# Altium schematic sheet Heartrate_Monitor_Internal.SchDoc: Heart Rate Monitor Internal
size A4; DocumentNumber: 8; SheetNumber: 8; SheetTotal: 31
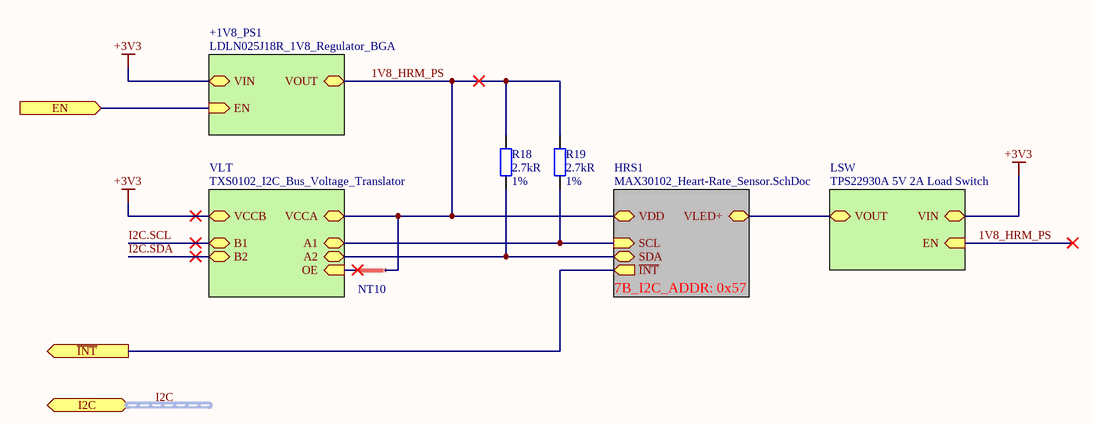
[diagram p0: Heartrate_Monitor_Internal.SchDoc]

## Parts
NT10  Net Tie  [Net Tie 6x30mil]  (value not drawn)  (net tie, no BOM)
R18  Resistance: 2.7kR  Tolerance: 1%  [R0402]  (hidden comment: RES SMD 2.7K OHM 1% 1/16W 0402)
R19  Resistance: 2.7kR  Tolerance: 1%  [R0402]  (hidden comment: RES SMD 2.7K OHM 1% 1/16W 0402)

## Sub-sheets
+1V8_PS1 = LDLN025J18R_1V8_Regulator_BGA: EN (in), VIN, VOUT
HRS1 = MAX30102_Heart-Rate_Sensor.SchDoc: ~{INT} (out), VDD, SCL (in), VLED+, SDA (bidir)  | 7B_I2C_ADDR: 0x57
LSW = TPS22930A 5V 2A Load Switch: EN (in), VOUT, VIN
VLT = TXS0102_I2C_Bus_Voltage_Translator: VCCA, VCCB, OE (in), A1 (bidir), A2 (bidir), B1 (bidir), B2 (bidir)

## Ports
EN (in), I2C (harness I2C), ~{INT} (out)

## Nets
+3V3: sheet +1V8_PS1/VIN, sheet VLT/VCCB, sheet LSW/VIN
1V8_HRM_PS: NT10.2 R18.2 R19.2 ; sheet HRS1/VDD, sheet +1V8_PS1/VOUT, sheet VLT/VCCA, sheet LSW/EN
~{INT}: port ~{INT}, sheet HRS1/~{INT}
EN: port EN, sheet +1V8_PS1/EN
I2C.SCL: sheet VLT/B1
I2C.SDA: sheet VLT/B2
NetNT10_1: NT10.1 ; sheet VLT/OE
NetR18_1: R18.1 ; sheet HRS1/SDA, sheet VLT/A2
NetR19_1: R19.1 ; sheet HRS1/SCL, sheet VLT/A1
(unnamed): sheet HRS1/VLED+, sheet LSW/VOUT

## Buses and harness runs
harness I2C = port I2C

## Notes on the sheet
- Title
- Size:
- Date:
- A4
- Number:
- Time:
- Revision:
- Sheet
- of
- File:

## Library data of the parts
NT10 = Net Tie Line: ClassName: Net Tie
R18 R19 = RES SMD 2.7K OHM 1% 1/16W 0402: 2.7 kOhms ±1% 0.063W, 1/16W Chip Resistor 0402 (1005 Metric) Moisture Resistant Thick Film; Manufacturer Part Number: RC0402FR-072K7L; Manufacturer: Yageo; Temperature Coefficient: 100ppm/°C; Voltage Rating: 50V; Power Rating: 63mW; Supplier 1: Digi-Key; Stock 1: 261850; Pricing 1: 1=0.1, 10=0.016, 100=0.0064, 1000=0.0029, 2500=0.0025, 5000=0.0021 (USD); Case Code (Imperial): 0402; Case Code (Metric): 1005; Min Operating Temperature: -55°C; Max Operating Temperature: 155°C; Composition: Thick Film; Packaging: Tape and Reel; Termination: SMD/SMT; Military Standard: Not; Working Voltage: 50V; Number of Terminations: 2; Length: 1mm; Height: 0.016inch; Width: 0.02inch; Depth: 0.5mm; REACH SVHC: Unknown; Lead Free: Lead Free; ComponentLink1URL: http://www.mouser.com/ds/2/447/PYu-RC0402_51_RoHS_L_6_r-8721.pdf?src-supplier=Mouser; ComponentLink1Description: http://www.mouser.com/ds/2/447/PYu-RC0402_51_RoHS_L_6_r-8721.pdf?src-supplier=Mouser; ComponentLink2URL: http://www.yageo.com/documents/recent/PYu-RC_Group_51_RoHS_L_9.pdf?src-supplier=Digi-Key; ComponentLink2Description: http://www.yageo.com/documents/recent/PYu-RC_Group_51_RoHS_L_9.pdf?src-supplier=Digi-Key; ComponentLink3URL: http://www.yageo.com/documents/recent/PYu-RC_Group_51_RoHS_L_10.pdf?src-supplier=Digi-Key; ComponentLink3Description: http://www.yageo.com/documents/recent/PYu-RC_Group_51_RoHS_L_10.pdf?src-supplier=Digi-Key; ComponentLink4URL: http://www.farnell.com/datasheets/2167052.pdf?src-supplier=Element14; ComponentLink4Description: http://www.farnell.com/datasheets/2167052.pdf?src-supplier=Element14; Supplier Part Number 1: 311-2.70KLRCT-ND; Case/Package: 0402; Package Quantity: 1; Max Power Dissipation: 63mW; Features: Moisture Resistant; ClassName: U_ESP32-WROOM32D_Module